# Altium project EVK-IRIS-W1-Mikro-Bus.PrjPcb (part 2 of 5)

## Sheet EVK-IRIS-W1-PIN-HEADERS_SDIO-HEADER.SchDoc
size A3; DocumentNumber: 13; SheetNumber: 13; SheetTotal: 14
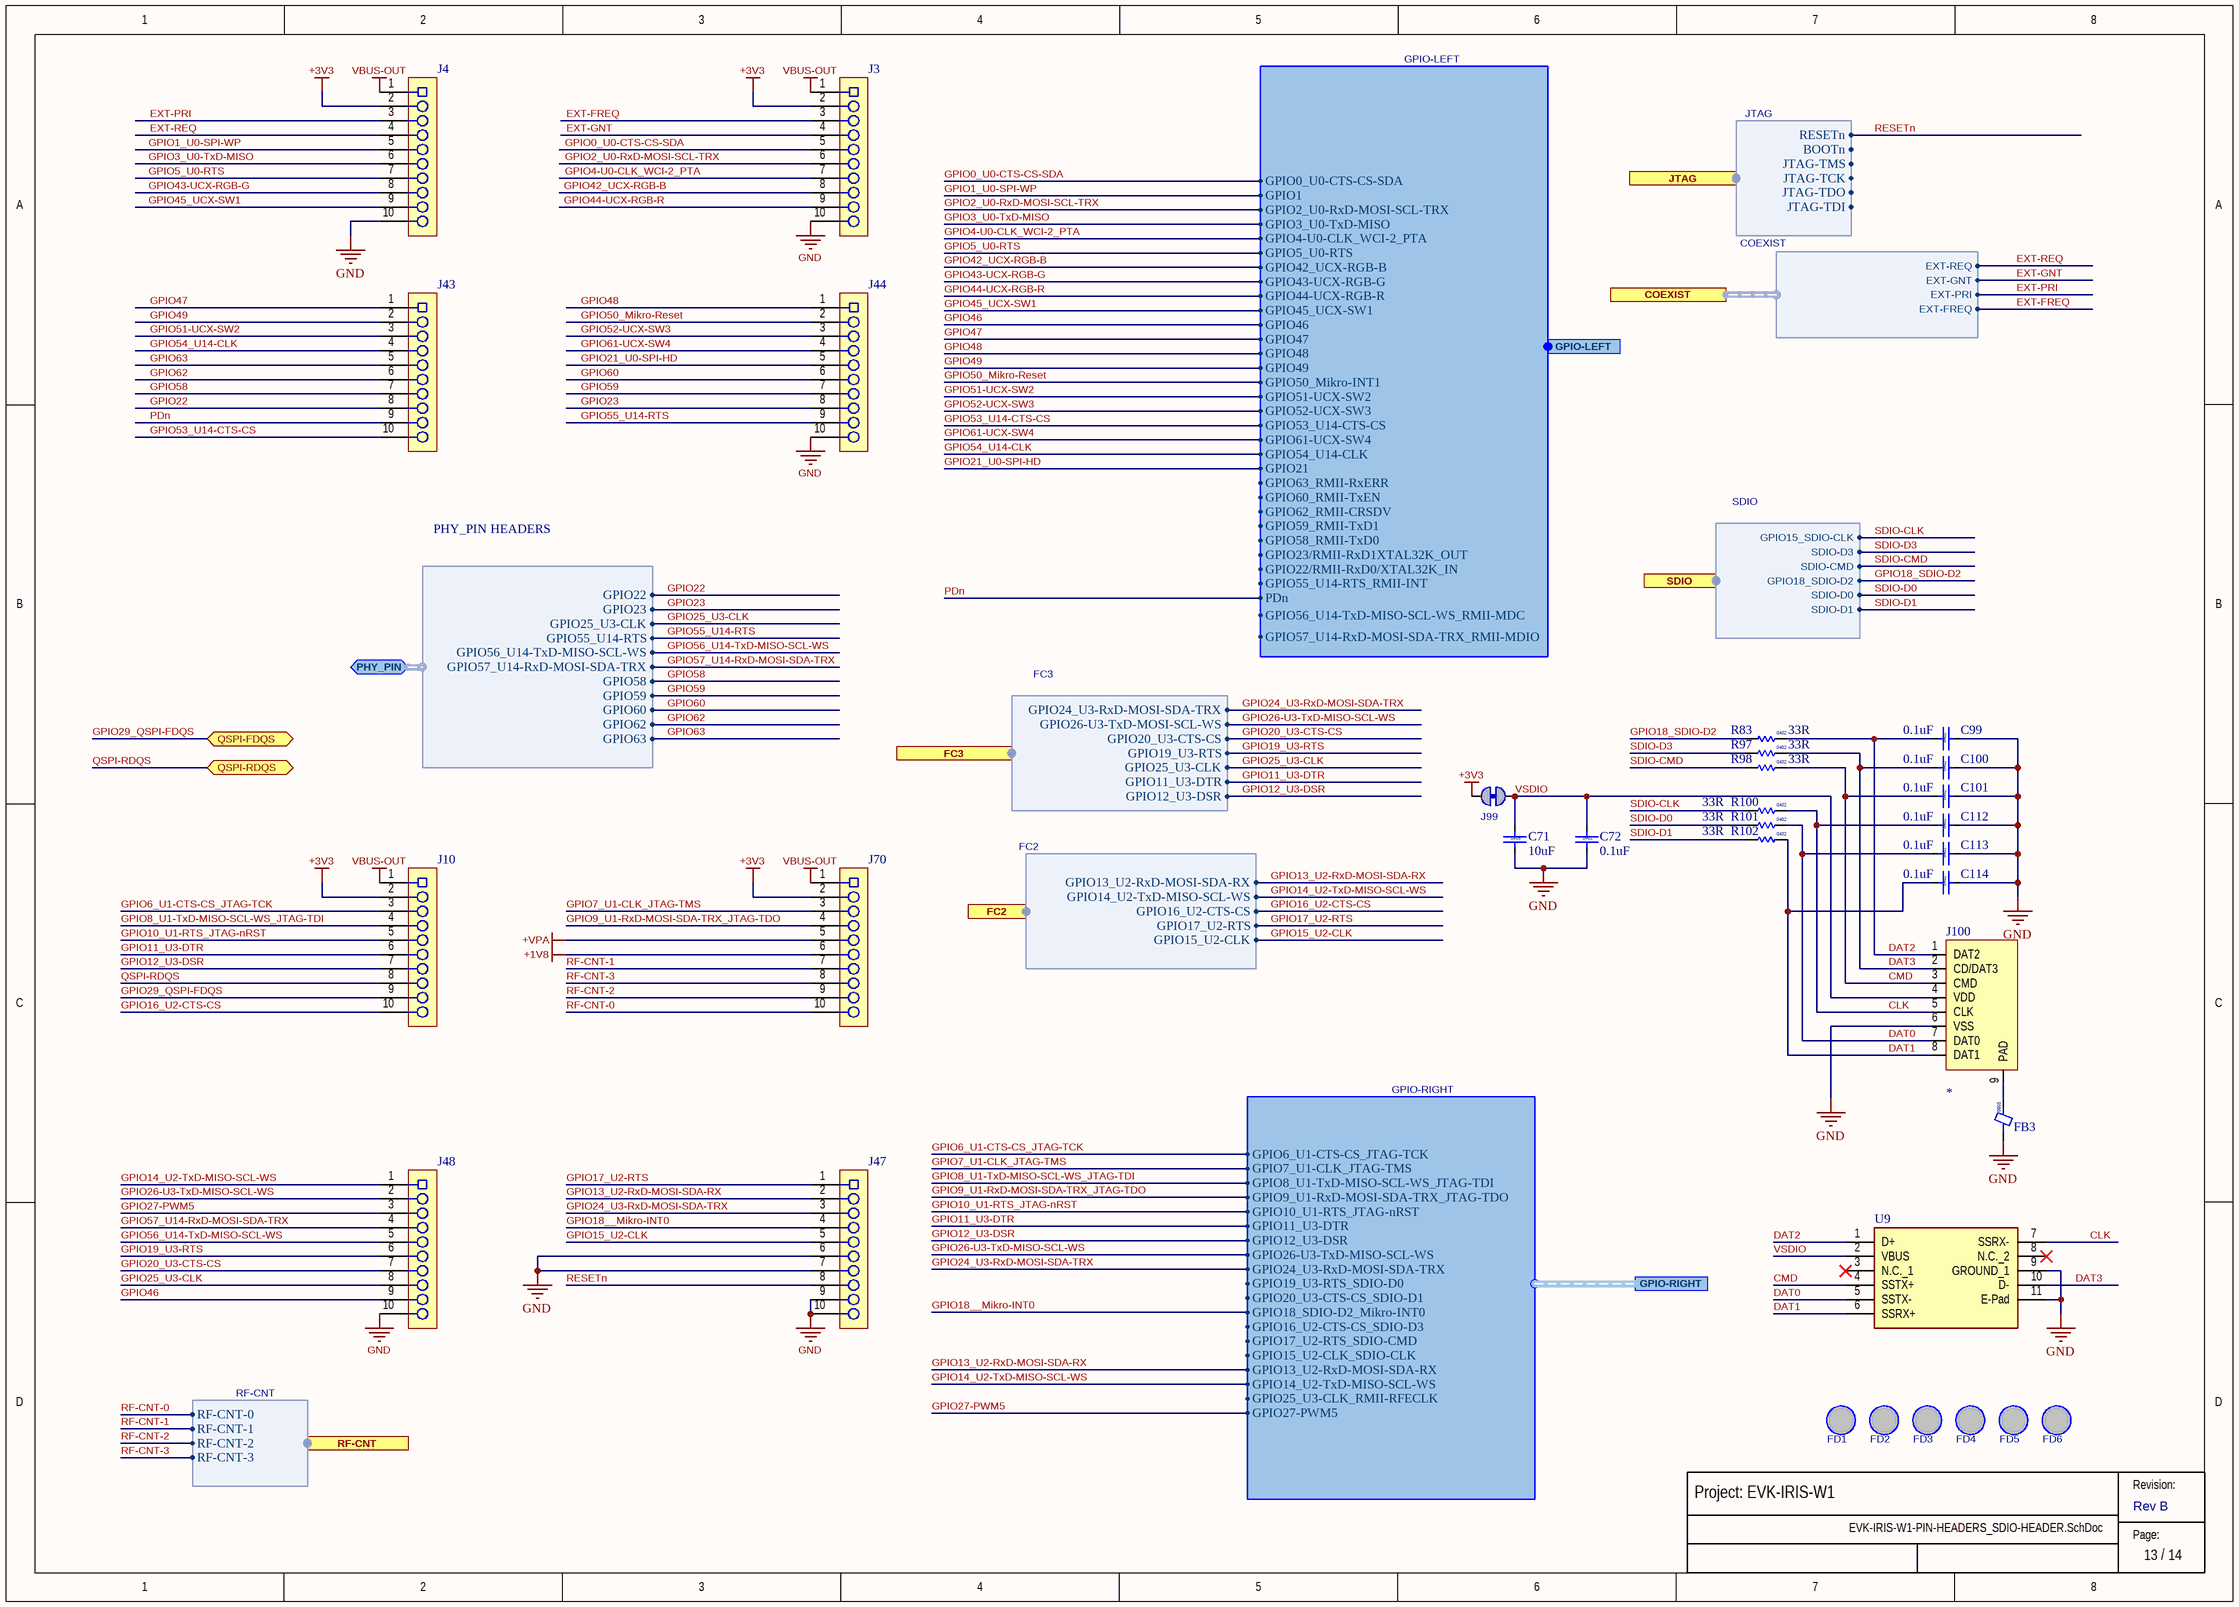
[diagram p4: EVK-IRIS-W1-PIN-HEADERS_SDIO-HEADER.SchDoc]

### Parts
C71  value 10uF  Size: 0805  [Cap 0805 HD]
C72  value 0.1uF  Size: 0402  [Cap 0402 HD]
C99  value 0.1uF  Size: 0402  [Cap 0402 HD]
C100  value 0.1uF  Size: 0402  [Cap 0402 HD]
C101  value 0.1uF  Size: 0402  [Cap 0402 HD]
C112  value 0.1uF  Size: 0402  [Cap 0402 HD]
C113  value 0.1uF  Size: 0402  [Cap 0402 HD]
C114  value 0.1uF  Size: 0402  [Cap 0402 HD]
FB3  Size: 0603  [BLM18EG221SN1]
FD1  Fiducial_1mmDNP  [Fiducial 1mm - Circle]  (value not drawn)  (no BOM)
FD2  Fiducial_1mmDNP  [Fiducial 1mm - Circle]  (value not drawn)  (no BOM)
FD3  Fiducial_1mmDNP  [Fiducial 1mm - Circle]  (value not drawn)  (no BOM)
FD4  Fiducial_1mmDNP  [Fiducial 1mm - Circle]  (value not drawn)  (no BOM)
FD5  Fiducial_1mmDNP  [Fiducial 1mm - Circle]  (value not drawn)  (no BOM)
FD6  Fiducial_1mmDNP  [Fiducial 1mm - Circle]  (value not drawn)  (no BOM)
J3  (no value)  [HDR-0.1P-10PIN-10x1-TH]
J4  (no value)  [HDR-0.1P-10PIN-10x1-TH]
J10  (no value)  [HDR-0.1P-10PIN-10x1-TH]
J43  (no value)  [HDR-0.1P-10PIN-10x1-TH]
J44  (no value)  [HDR-0.1P-10PIN-10x1-TH]
J47  (no value)  [HDR-0.1P-10PIN-10x1-TH]
J48  (no value)  [HDR-0.1P-10PIN-10x1-TH]
J70  (no value)  [HDR-0.1P-10PIN-10x1-TH]
J99  Solderbridge-ShortDNP  [Solderbridge-Short]  (value not drawn)  (net tie, no BOM)
J100  (no value)  [Micro_SD_SKT_SMT_RA]
R83  value 33R  Size: 0402  [RES 0402 HD]
R97  value 33R  Size: 0402  [RES 0402 HD]
R98  value 33R  Size: 0402  [RES 0402 HD]
R100  value 33R  Size: 0402  [RES 0402 HD]
R101  value 33R  Size: 0402  [RES 0402 HD]
R102  value 33R  Size: 0402  [RES 0402 HD]
U9  (no value)  [DFN10]

### Ports
COEXIST (harness COEXIST), FC2 (harness FC2), FC3 (harness FC3), GPIO-LEFT (harness GPIO-LEFT), GPIO-RIGHT (harness GPIO-RIGHT), JTAG (harness JTAG), PHY_PIN (bidir, harness PHY_PIN HEADERS), QSPI-FDQS (bidir), QSPI-RDQS (bidir), RF-CNT (harness RF-CNT), SDIO (harness SDIO)

### Harnesses
GPIO-RIGHT: GPIO6_U1-CTS-CS_JTAG-TCK, GPIO7_U1-CLK_JTAG-TMS, GPIO8_U1-TxD-MISO-SCL-WS_JTAG-TDI, GPIO9_U1-RxD-MOSI-SDA-TRX_JTAG-TDO, GPIO10_U1-RTS_JTAG-nRST, GPIO11_U3-DTR, GPIO12_U3-DSR, GPIO26-U3-TxD-MISO-SCL-WS, GPIO24_U3-RxD-MOSI-SDA-TRX, GPIO19_U3-RTS_SDIO-D0, GPIO20_U3-CTS-CS_SDIO-D1, GPIO18_SDIO-D2_Mikro-INT0, GPIO16_U2-CTS-CS_SDIO-D3, GPIO17_U2-RTS_SDIO-CMD, GPIO15_U2-CLK_SDIO-CLK, GPIO13_U2-RxD-MOSI-SDA-RX, GPIO14_U2-TxD-MISO-SCL-WS, GPIO25_U3-CLK_RMII-RFECLK, GPIO27-PWM5
RF-CNT: RF-CNT-0, RF-CNT-1, RF-CNT-2, RF-CNT-3
GPIO-LEFT: GPIO0_U0-CTS-CS-SDA, GPIO1, GPIO2_U0-RxD-MOSI-SCL-TRX, GPIO3_U0-TxD-MISO, GPIO4-U0-CLK_WCI-2_PTA, GPIO5_U0-RTS, GPIO42_UCX-RGB-B, GPIO43-UCX-RGB-G, GPIO44-UCX-RGB-R, GPIO45_UCX-SW1, GPIO46, GPIO47, GPIO48, GPIO49, GPIO50_Mikro-INT1, GPIO51-UCX-SW2, GPIO52-UCX-SW3, GPIO53_U14-CTS-CS, GPIO61-UCX-SW4, GPIO54_U14-CLK, GPIO21, GPIO63_RMII-RxERR, GPIO60_RMII-TxEN, GPIO62_RMII-CRSDV, GPIO59_RMII-TxD1, GPIO58_RMII-TxD0, GPIO23/RMII-RxD1XTAL32K_OUT, GPIO22/RMII-RxD0/XTAL32K_IN, GPIO55_U14-RTS_RMII-INT, PDn, GPIO56_U14-TxD-MISO-SCL-WS_RMII-MDC, GPIO57_U14-RxD-MOSI-SDA-TRX_RMII-MDIO
COEXIST: EXT-REQ, EXT-GNT, EXT-PRI, EXT-FREQ
SDIO: GPIO15_SDIO-CLK, SDIO-D3, SDIO-CMD, GPIO18_SDIO-D2, SDIO-D0, SDIO-D1
JTAG: JTAG-TCK, JTAG-TDI, JTAG-TDO, JTAG-TMS, BOOTn, RESETn
PHY_PIN HEADERS: GPIO22, GPIO23, GPIO25_U3-CLK, GPIO55_U14-RTS, GPIO56_U14-TxD-MISO-SCL-WS, GPIO57_U14-RxD-MOSI-SDA-TRX, GPIO58, GPIO59, GPIO60, GPIO62, GPIO63
FC2: GPIO13_U2-RxD-MOSI-SDA-RX, GPIO14_U2-TxD-MISO-SCL-WS, GPIO16_U2-CTS-CS, GPIO17_U2-RTS, GPIO15_U2-CLK
FC3: GPIO20_U3-CTS-CS, GPIO19_U3-RTS, GPIO24_U3-RxD-MOSI-SDA-TRX, GPIO26-U3-TxD-MOSI-SCL-WS, GPIO25_U3-CLK, GPIO11_U3-DTR, GPIO12_U3-DSR

### Nets
+1V8: J70.6
+3V3: J3.2 J4.2 J10.2 J70.2 J99.1
+VPA: J70.5
GND: C71.2 C72.2 C99.2 C100.2 C101.2 C112.2 C113.2 C114.2 FB3.1 J3.10 J4.10 J44.10 J47.6 J47.7 J47.9 J47.10 J48.10 J100.6(VSS) U9.9(GROUND_1) U9.11(E-Pad)
VBUS-OUT: J3.1 J4.1 J10.1 J70.1
CLK: C112.1 J100.5(CLK) R100.2 U9.7(SSRX-)
CMD: C101.1 J100.3(CMD) R98.2 U9.4(SSTX+)
DAT0: C113.1 J100.7(DAT0) R101.2 U9.5(SSTX-)
DAT1: C114.1 J100.8(DAT1) R102.2 U9.6(SSRX+)
DAT2: C99.1 J100.1(DAT2) R83.2 U9.1(D+)
DAT3: C100.1 J100.2(CD/DAT3) R97.2 U9.10(D-)
EXT-FREQ: J3.3 ; port COEXIST.EXT-FREQ
EXT-GNT: J3.4 ; port COEXIST.EXT-GNT
EXT-PRI: J4.3 ; port COEXIST.EXT-PRI
EXT-REQ: J4.4 ; port COEXIST.EXT-REQ
GPIO0_U0-CTS-CS-SDA: J3.5 ; port GPIO-LEFT.GPIO0_U0-CTS-CS-SDA
GPIO1_U0-SPI-WP: J4.5 ; port GPIO-LEFT.GPIO1
GPIO2_U0-RxD-MOSI-SCL-TRX: J3.6 ; port GPIO-LEFT.GPIO2_U0-RxD-MOSI-SCL-TRX
GPIO3_U0-TxD-MISO: J4.6 ; port GPIO-LEFT.GPIO3_U0-TxD-MISO
GPIO4-U0-CLK_WCI-2_PTA: J3.7 ; port GPIO-LEFT.GPIO4-U0-CLK_WCI-2_PTA  [project net GPIO4-U0-CLK]
GPIO5_U0-RTS: J4.7 ; port GPIO-LEFT.GPIO5_U0-RTS
GPIO6_U1-CTS-CS_JTAG-TCK: J10.3 ; port GPIO-RIGHT.GPIO6_U1-CTS-CS_JTAG-TCK
GPIO7_U1-CLK_JTAG-TMS: J70.3 ; port GPIO-RIGHT.GPIO7_U1-CLK_JTAG-TMS
GPIO8_U1-TxD-MISO-SCL-WS_JTAG-TDI: J10.4 ; port GPIO-RIGHT.GPIO8_U1-TxD-MISO-SCL-WS_JTAG-TDI
GPIO9_U1-RxD-MOSI-SDA-TRX_JTAG-TDO: J70.4 ; port GPIO-RIGHT.GPIO9_U1-RxD-MOSI-SDA-TRX_JTAG-TDO
GPIO10_U1-RTS_JTAG-nRST: J10.5 ; port GPIO-RIGHT.GPIO10_U1-RTS_JTAG-nRST
GPIO11_U3-DTR: J10.6 ; port GPIO-RIGHT.GPIO11_U3-DTR, port FC3.GPIO11_U3-DTR
GPIO12_U3-DSR: J10.7 ; port GPIO-RIGHT.GPIO12_U3-DSR, port FC3.GPIO12_U3-DSR
GPIO13_U2-RxD-MOSI-SDA-RX: J47.2 ; port GPIO-RIGHT.GPIO13_U2-RxD-MOSI-SDA-RX, port FC2.GPIO13_U2-RxD-MOSI-SDA-RX
GPIO14_U2-TxD-MISO-SCL-WS: J48.1 ; port GPIO-RIGHT.GPIO14_U2-TxD-MISO-SCL-WS, port FC2.GPIO14_U2-TxD-MISO-SCL-WS
GPIO15_U2-CLK: J47.5 ; port FC2.GPIO15_U2-CLK
GPIO16_U2-CTS-CS: J10.10 ; port FC2.GPIO16_U2-CTS-CS
GPIO17_U2-RTS: J47.1 ; port FC2.GPIO17_U2-RTS
GPIO18__Mikro-INT0: J47.4 ; port GPIO-RIGHT.GPIO18_SDIO-D2_Mikro-INT0
GPIO18_SDIO-D2: R83.1 ; port SDIO.GPIO18_SDIO-D2
GPIO19_U3-RTS: J48.6 ; port FC3.GPIO19_U3-RTS
GPIO20_U3-CTS-CS: J48.7 ; port FC3.GPIO20_U3-CTS-CS
GPIO21_U0-SPI-HD: J44.5 ; port GPIO-LEFT.GPIO21
GPIO22: J43.8 ; port PHY_PIN.GPIO22
GPIO23: J44.8 ; port PHY_PIN.GPIO23
GPIO24_U3-RxD-MOSI-SDA-TRX: J47.3 ; port GPIO-RIGHT.GPIO24_U3-RxD-MOSI-SDA-TRX, port FC3.GPIO24_U3-RxD-MOSI-SDA-TRX
GPIO25_U3-CLK: J48.8 ; port PHY_PIN.GPIO25_U3-CLK, port FC3.GPIO25_U3-CLK
GPIO26-U3-TxD-MISO-SCL-WS: J48.2 ; port GPIO-RIGHT.GPIO26-U3-TxD-MISO-SCL-WS, port FC3.GPIO26-U3-TxD-MOSI-SCL-WS
GPIO27-PWM5: J48.3 ; port GPIO-RIGHT.GPIO27-PWM5
GPIO29_QSPI-FDQS: J10.9 ; port QSPI-FDQS
GPIO42_UCX-RGB-B: J3.8 ; port GPIO-LEFT.GPIO42_UCX-RGB-B
GPIO43-UCX-RGB-G: J4.8 ; port GPIO-LEFT.GPIO43-UCX-RGB-G
GPIO44-UCX-RGB-R: J3.9 ; port GPIO-LEFT.GPIO44-UCX-RGB-R
GPIO45_UCX-SW1: J4.9 ; port GPIO-LEFT.GPIO45_UCX-SW1
GPIO46: J48.9 ; port GPIO-LEFT.GPIO46
GPIO47: J43.1 ; port GPIO-LEFT.GPIO47
GPIO48: J44.1 ; port GPIO-LEFT.GPIO48
GPIO49: J43.2 ; port GPIO-LEFT.GPIO49
GPIO50_Mikro-Reset: J44.2 ; port GPIO-LEFT.GPIO50_Mikro-INT1
GPIO51-UCX-SW2: J43.3 ; port GPIO-LEFT.GPIO51-UCX-SW2
GPIO52-UCX-SW3: J44.3 ; port GPIO-LEFT.GPIO52-UCX-SW3
GPIO53_U14-CTS-CS: J43.10 ; port GPIO-LEFT.GPIO53_U14-CTS-CS
GPIO54_U14-CLK: J43.4 ; port GPIO-LEFT.GPIO54_U14-CLK
GPIO55_U14-RTS: J44.9 ; port PHY_PIN.GPIO55_U14-RTS
GPIO56_U14-TxD-MISO-SCL-WS: J48.5 ; port PHY_PIN.GPIO56_U14-TxD-MISO-SCL-WS
GPIO57_U14-RxD-MOSI-SDA-TRX: J48.4 ; port PHY_PIN.GPIO57_U14-RxD-MOSI-SDA-TRX
GPIO58: J43.7 ; port PHY_PIN.GPIO58
GPIO59: J44.7 ; port PHY_PIN.GPIO59
GPIO60: J44.6 ; port PHY_PIN.GPIO60
GPIO61-UCX-SW4: J44.4 ; port GPIO-LEFT.GPIO61-UCX-SW4
GPIO62: J43.6 ; port PHY_PIN.GPIO62
GPIO63: J43.5 ; port PHY_PIN.GPIO63
PDn: J43.9 ; port GPIO-LEFT.PDn
QSPI-RDQS: J10.8 ; port QSPI-RDQS
RESETn: J47.8 ; port JTAG.RESETn
RF-CNT-0: J70.10 ; port RF-CNT.RF-CNT-0
RF-CNT-1: J70.7 ; port RF-CNT.RF-CNT-1
RF-CNT-2: J70.9 ; port RF-CNT.RF-CNT-2
RF-CNT-3: J70.8 ; port RF-CNT.RF-CNT-3
SDIO-CLK: R100.1 ; port SDIO.GPIO15_SDIO-CLK
SDIO-CMD: R98.1 ; port SDIO.SDIO-CMD
SDIO-D0: R101.1 ; port SDIO.SDIO-D0
SDIO-D1: R102.1 ; port SDIO.SDIO-D1
SDIO-D3: R97.1 ; port SDIO.SDIO-D3
VSDIO: C71.1 C72.1 J99.2 J100.4(VDD) U9.2(VBUS)
NetFB3_2: FB3.2 J100.9(PAD)

Not connected (* = marked no-connect by the designer): U9 3(N.C._1)* 8(N.C._2)*

### Notes on the sheet
- Revision:
- Page:

### Library data of the parts
C71 = 120-00133: Capacitor, Ceramic, 10uF 16V 10% X7R, 0805; Manufacturer 1: Samsung Electro-Mechanics America, Inc.; Manufacturer Part Number 1: CL21B106KOQNNNE; Part Name: CAP CER 10uF 16V 10% X7R 0805; Item Phase: Pre-Production; Tolerance: +/- 10%; Use in new designs: Yes; UBX Code: None; Part Number: 120-00133; Supplier 1: Digi-Key; Supplier Part Number 1: 1276-2872-1-ND; Manufacturer 2: Yageo; Manufacturer Part Number 2: CC0805KKX7R7BB106; Supplier 2: Digi-Key; Supplier Part Number 2: 311-3501-2-ND; Height: 1.40mm; Max Operating Temp: 125; Min Operating Temp: -55; Pins: 2; Revision: 1; Temperature Coefficient: X7R; Voltage: 16V
C72 C99-C101 C112-C114 = 120-00077: Cap, Ceramic 0.1uF 16V 10% X7R 0402.; Manufacturer 1: Murata Electronics North America; Manufacturer Part Number 1: GRM155R71C104KA88D; Part Name: CAP CER 0.1uF 16V 10% X7R 0402; Item Phase: In Production; Tolerance: +/- 10%; Use in new designs: Yes; UBX Code: None; Part Number: 120-00077; Supplier 1: Digi-Key; Supplier Part Number 1: 490-3261-1-ND; Manufacturer 2: AVX Corporation; Manufacturer Part Number 2: 0402YC104KAT2A; Supplier 2: Digi-Key; Supplier Part Number 2: 478-7888-1-ND; Height: 0.55mm; Max Operating Temp: 125; Min Operating Temp: -55; Pins: 2; Revision: 0C; Temperature Coefficient: X7R; Voltage: 16V
FB3 = BLM18EG221SN1: Ferrite Bead, 220ohm @ 100MHz, 2A, 0603; Manufacturer 1: Murata Electronics North America; Manufacturer Part Number 1: BLM18EG221SN1D; Part Name: Ferrite Bead 220ohm 2A 0503; Body Size: None; Item Phase: Unreleased; Use in new designs: Yes; Value: None; Part Number: BLM18EG221SN1; Supplier 1: Digi-Key; Supplier Part Number 1: 490-3992-2-ND; Current: 2A; Height: 0.8mm; MFG Package: None; Max Operating Temp: 85; Min Operating Temp: -55; Pins: None; Revision: None; Voltage: None; Manufacturer 2: None; Manufacturer Part Number 2: None; Supplier 2: None; Supplier Part Number 2: None; UBX Code: None
FD1-FD6 = Fiducial_1mm_Circle: 1mm Fiducial Target; Added By: EMOO; Part Number: Fiducial_1mm; Height: 0; DNP: DNP; Added Date: 12/12/2020
J3 J4 J10 J43 J44 J47 J48 J70 = 130-00046: Header, 0.100" Pitch, 10Pin, 10x1, Through Hole; Part Name: CON Header 0.1in 10Pin 1Row TH; Manufacturer 1: FCI; Manufacturer Part Number 1: 68002-210HLF; Use in new designs: Yes; Item Phase: Unreleased; Voltage: None; Part Number: 130-00046; Height: 0.32"; Pins: 10; Diameter: None; Max Operating Temp: None; Min Operating Temp: None; Revision: None; UBX Code: None; Manufacturer 2: None; Supplier 1: Digi-Key; Supplier Part Number 1: 609-3301-ND; Manufacturer Part Number 2: None; Supplier 2: None; Supplier Part Number 2: None; Manufacturer P/N: *
J99 = Solderbridge-Short: Added By: Paul B; Part Number: Solderbridge-Short; Height: 0; DNP: DNP; Added Date: 12/2/2015
J100 = 130-00062: Micro SD Card Socket, Right Angle, with 4 Ground Pads, SMT; Manufacturer 1: Molex Inc; Manufacturer Part Number 1: 0472192001; Part Name: CON Micro SD 1.1mm 8Pin 1Row SMT RA; Item Phase: In Production; Use in new designs: Yes; Voltage: None; Manufacturer P/N: *; Part Number: 130-00062; Supplier 1: Digi-Key; Supplier Part Number 1: WM6698CT-ND; Diameter: None; Height: 1.9mm; Max Operating Temp: None; Min Operating Temp: None; Pins: 8; Revision: 0A; UBX Code: None; Manufacturer 2: None; Manufacturer Part Number 2: None; Supplier 2: None; Supplier Part Number 2: None
R83 R97 R98 R100-R102 = UBXH18-0008013: RES THICK FILM CHIP 0402 33R 5% 50V 63mW; Manufacturer: KOA; Manufacturer P/N: RK73B1ETTP330J; Editor: matej.budin; Env: ROHS; Permitted Use: Volume Products; Perferred: PREF; Mfg P/N Status: Active; Mfg P/N Split: 100; Mfg P/N Released: Yes; Released by: erian.bezhani; Part Number: UBXH18-0008013; Tolerance: 5%; Max Power: 63mW; Part Type: Resistor; UBX Wiki: https://wiki.u-blox.com/bin/view/Operations/PartDetails?index=6887; RefDes: R; Max Voltage: 50V; Release Data: 2013-01-10T15:04:42; Mfg P/N Datasheet: https://wiki.u-blox.com/bin/view/Generic/Docs/DocumentSummary?index=18259
U9 = CDDFN10-0516P: 4.5V, 7.2V Clamp 4A (8/20µs) Ipp Tvs Diode Surface Mount 10-DFN (4.1x2); Mfr_Name: BOURNS; RefDes: RefDes; Type: Type; Manufacturer P/N: *

## Sheet EVK-IRIS-W1-PowerSchDoc.SchDoc
size A3; DocumentNumber: 3; SheetNumber: 3; SheetTotal: 14
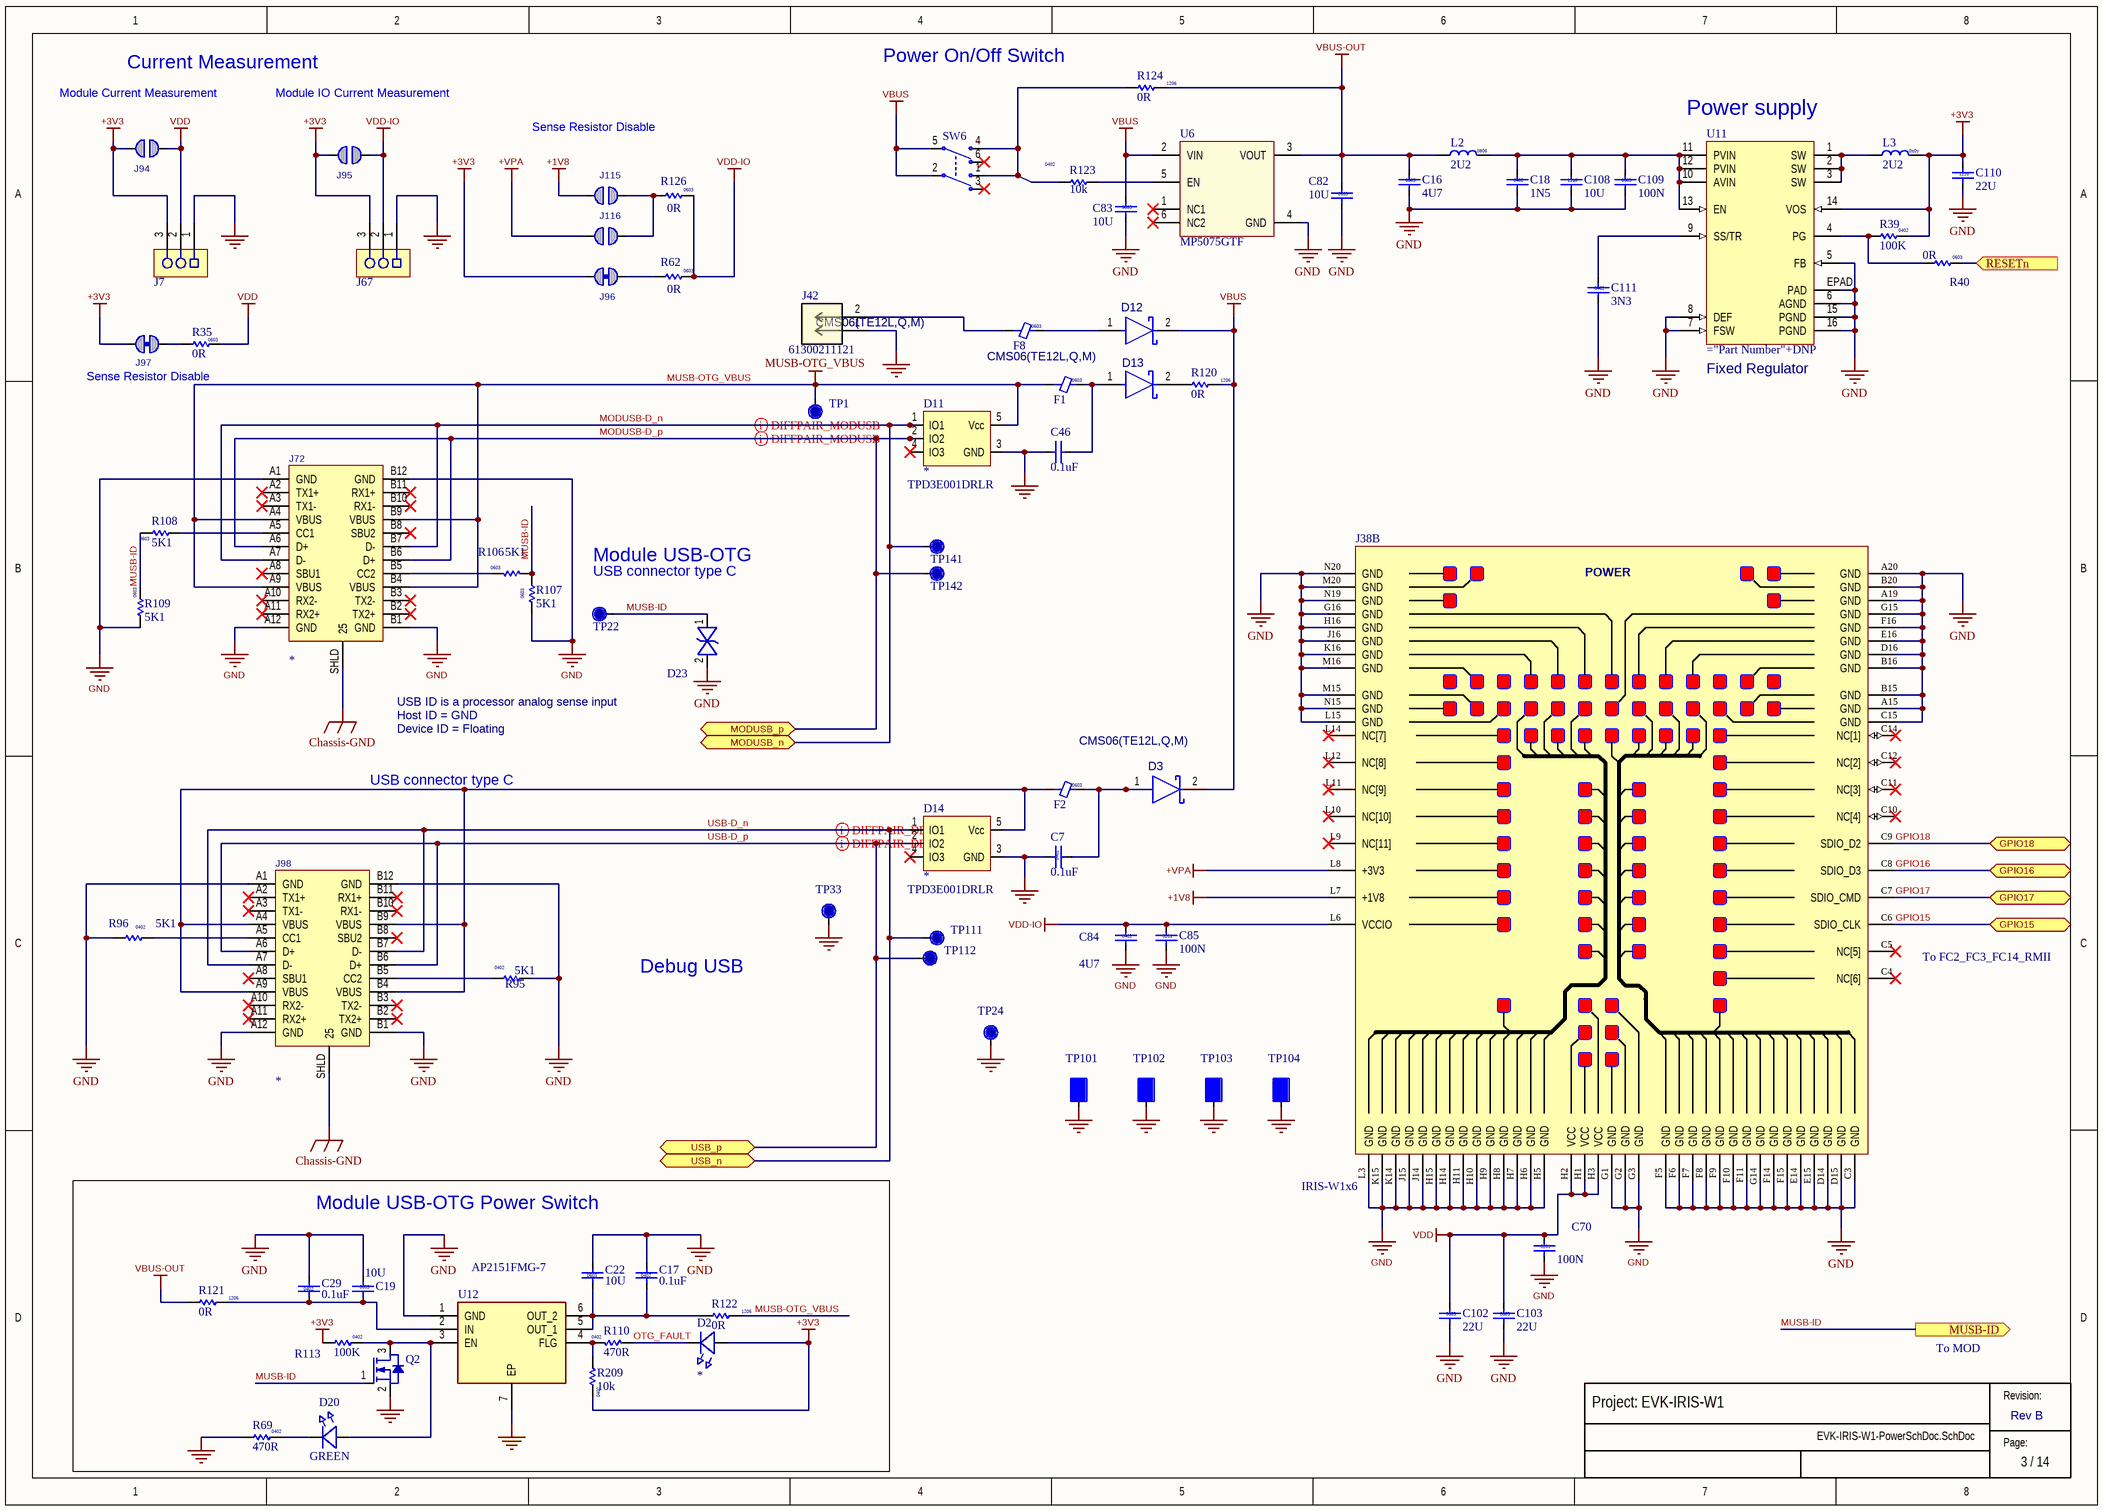
[diagram p5: EVK-IRIS-W1-PowerSchDoc.SchDoc]

### Parts
C7  value 0.1uF  Size: 0402  [Cap 0402 HD]
C16  value 4U7  Size: 0805  [Cap 0805]
C17  value 0.1uF  Size: 0402  [Cap 0402 HD]
C18  value 1N5  Size: 0402  [CAP 0402]
C19  value 10U  Size: 0603  [Cap 0603 HD]
C22  value 10U  Size: 0603  [Cap 0603 HD]
C29  value 0.1uF  Size: 0402  [Cap 0402 HD]
C46  value 0.1uF  [Cap 0402 HD]
C70  value 100N  Size: 0201  [Cap 0201 HD]
C82  value 10U  Size: 0603  [Cap 0603 HD]
C83  value 10U  Size: 0603  [Cap 0603 HD]
C84  value 4U7  Size: 0402  [Cap 0402 HD]
C85  value 100N  Size: 0201  [Cap 0201 HD]
C102  value 22U  Size: 0603  [Cap 0603]
C103  value 22U  Size: 0603  [Cap 0603]
C108  value 10U  Size: 1210  [Cap 1210]
C109  value 100N  Size: 0603  [Cap 0603 HD]
C110  value 22U  Size: 1210  [Cap 1210]
C111  value 3N3  Size: 0402  [CAP 0402]
D2  (no value)  [LED-0603]
D3  CMS06(TE12L,Q,M)  [FP-M-FLAT-MFG]
D11  Manufacturer Part Number 1: TPD3E001DRLR  [SOT-553]
D12  CMS06(TE12L,Q,M)  [FP-M-FLAT-MFG]
D13  CMS06(TE12L,Q,M)  [FP-M-FLAT-MFG]
D14  Manufacturer Part Number 1: TPD3E001DRLR  [SOT-553]
D20  value GREEN  [LED-0603]
D23  (no value)  [SOD-923]
F1  Size: 0603  [IND 0603]
F2  Size: 0603  [IND 0603]
F8  Size: 0603  [IND 0603]
J7  (no value)  [HDR-0.1P-3Pin-1Row-SMT]
J38  IRIS-W1x6  [IRIS-W1x6_LGA152]  (part B of 2)
J42  61300211121  [CONN_61300211121_WRE]
J67  (no value)  [HDR-0.1P-3Pin-1Row-SMT]
J72  (no value)  [CON_USB-C-RA_W-6Tabs]
J94  Solderbridge-OpenDNP  [Solderbridge-Open]  (value not drawn)  (no BOM)
J95  Solderbridge-OpenDNP  [Solderbridge-Open]  (value not drawn)  (no BOM)
J96  Solderbridge-ShortDNP  [Solderbridge-Short]  (value not drawn)  (net tie, no BOM)
J97  Solderbridge-ShortDNP  [Solderbridge-Short]  (value not drawn)  (net tie, no BOM)
J98  (no value)  [CON_USB-C-RA_W-6Tabs]
J115  Solderbridge-OpenDNP  [Solderbridge-Open]  (value not drawn)  (no BOM)
J116  Solderbridge-OpenDNP  [Solderbridge-Open]  (value not drawn)  (no BOM)
L2  value 2U2  Size: 0806  [IND 0806]
L3  value 2U2  Size: 0x0y  [Ind_4mmx4mm]
Q2  (no value)  [SOT-323]
R35  value 0R  Size: 0603  [RES 0603 HD]
R39  value 100K  Size: 0402  [RES 0402 HD]
R40  value 0R  Size: 0603  [RES 0603 HD]
R62  value 0R  Size: 0603  [RES 0603 HD]
R69  value 470R  Size: 0402  [RES 0402 HD]
R95  value 5K1  Size: 0402  [RES 0402 HD]
R96  value 5K1  Size: 0402  [RES 0402 HD]
R106  value 5K1  Size: 0603  [RES 0603 HD]
R107  value 5K1  Size: 0603  [RES 0603 HD]
R108  value 5K1  Size: 0603  [RES 0603 HD]
R109  value 5K1  Size: 0603  [RES 0603 HD]
R110  value 470R  Size: 0402  [RES 0402 HD]
R113  value 100K  Size: 0402  [RES 0402 HD]
R120  value 0R  Size: 1206  [RES 1206]
R121  value 0R  Size: 1206  [RES 1206]
R122  value 0R  Size: 1206  [RES 1206]
R123  value 10k  Size: 0402  [RES 0402 HD]
R124  value 0R  Size: 1206  [RES 1206]
R126  value 0R  Size: 0603  [RES 0603 HD]  (hidden comment: R126)
R209  value 10k  Size: 0402  [RES 0402 HD]
SW6  (no value)  [SW_Slide_DPDT_JS202011SCQN]
TP1  TP  [TP10R]  (value not drawn)
TP22  TP  [TP10R]  (value not drawn)
TP24  TP  [TP10R]  (value not drawn)
TP33  TP  [TP10R]  (value not drawn)
TP101  TP4.5x3SqDNP  [TP4.5x3Sq]  (value not drawn)
TP102  TP4.5x3SqDNP  [TP4.5x3Sq]  (value not drawn)
TP103  TP4.5x3SqDNP  [TP4.5x3Sq]  (value not drawn)
TP104  TP4.5x3SqDNP  [TP4.5x3Sq]  (value not drawn)
TP111  TP  [TP10R]  (value not drawn)
TP112  TP  [TP10R]  (value not drawn)
TP141  TP  [TP10R]  (value not drawn)
TP142  TP  [TP10R]  (value not drawn)
U6  MP5075GTF  [SOT-563]
U11  (no value)  [QFN0.5P3x3-16Pin_W-Pad]
U12  AP2151FMG-7  [SON50P201X181X60-7N]

### Blocks framed on the sheet
Module USB-OTG Power Switch: C17 C19 C22 C29 D2 D20 Q2 R69 R110 R113 R121 R122 R209 U12

### Ports
GPIO15 (bidir), GPIO16 (bidir), GPIO17 (bidir), GPIO18 (bidir), MODUSB_n (bidir), MODUSB_p (bidir), MUSB-ID (out), RESETn (in), USB_n (bidir), USB_p (bidir)

### Nets
+1V8: J38.L7(+1V8) J115.1
+3V3: C110.1 D2.2(A) J7.3 J67.3 J94.1 J95.1 J96.1 J97.1 L3.2 R39.2 R113.1 R209.2 U11.14(VOS)
+VPA: J38.L8(+3V3) J116.1
Chassis-GND: J72.SHLD(25) J98.SHLD(25)
GND: C7.1 C16.2 C17.2 C18.2 C19.1 C22.1 C29.2 C46.1 C70.2 C82.2 C83.2 C84.2 C85.2 C102.2 C103.2 C108.2 C109.2 C110.2 C111.2 D11.3(GND) D14.3(GND) D23.2 J7.1 J38.A15(GND) J38.A19(GND) J38.A20(GND) J38.B15(GND) J38.B16(GND) J38.B20(GND) J38.C3(GND) J38.C15(GND) J38.D14(GND) J38.D15(GND) J38.D16(GND) J38.E14(GND) J38.E15(GND) J38.E16(GND) J38.F5(GND) J38.F6(GND) J38.F7(GND) J38.F8(GND) J38.F9(GND) J38.F10(GND) J38.F11(GND) J38.F14(GND) J38.F15(GND) J38.F16(GND) J38.G1(GND) J38.G2(GND) J38.G3(GND) J38.G14(GND) J38.G15(GND) J38.G16(GND) J38.H5(GND) J38.H6(GND) J38.H7(GND) J38.H8(GND) J38.H9(GND) J38.H10(GND) J38.H11(GND) J38.H14(GND) J38.H15(GND) J38.H16(GND) J38.J14(GND) J38.J15(GND) J38.J16(GND) J38.K14(GND) J38.K15(GND) J38.K16(GND) J38.L3(GND) J38.L15(GND) J38.M15(GND) J38.M16(GND) J38.M20(GND) J38.N15(GND) J38.N19(GND) J38.N20(GND) J42.1 J67.1 J72.A1(GND) J72.A12(GND) J72.B1(GND) J72.B12(GND) J98.A1(GND) J98.A12(GND) J98.B1(GND) J98.B12(GND) Q2.2(S) R69.1 R95.2 R96.1 R107.2 R109.1 TP24.1 TP33.1 TP101.1 TP102.1 TP103.1 TP104.1 U6.4(GND) U11.5(FB) U11.6(AGND) U11.7(FSW) U11.8(DEF) U11.15(PGND) U11.16(PGND) U11.EPAD(PAD) U12.1(GND) U12.7(EP)
MUSB-OTG_VBUS: D11.5(Vcc) F1.1 J72.A4(VBUS) J72.A9(VBUS) J72.B4(VBUS) J72.B9(VBUS) R122.2 TP1.1
VBUS: C83.1 D3.2(C) D12.2(C) R120.2 SW6.2(COM-1) SW6.5(COM-2) U6.2(VIN)
VBUS-OUT: C16.1 C82.1 L2.1 R121.1 R124.2 U6.3(VOUT)
VDD: C70.1 C102.1 C103.1 J7.2 J38.H1(VCC) J38.H2(VCC) J38.H3(VCC) J94.2 R35.1
VDD-IO: C84.1 C85.1 J38.L6(VCCIO) J67.2 J95.2 R62.2 R126.2
GPIO15: J38.C6(SDIO_CLK) ; port GPIO15
GPIO16: J38.C8(SDIO_D3) ; port GPIO16
GPIO17: J38.C7(SDIO_CMD) ; port GPIO17
GPIO18: J38.C9(SDIO_D2) ; port GPIO18
MODUSB-D_n: D11.1(IO1) J72.A7(D-) J72.B7(D-) TP141.1 ; port MODUSB_n
MODUSB-D_p: D11.2(IO2) J72.A6(D+) J72.B6(D+) TP142.1 ; port MODUSB_p
MUSB-ID: D23.1 Q2.1(G) R106.1 R107.1 R108.2 R109.2 TP22.1 ; port MUSB-ID
OTG_FAULT: D2.1(C) R110.1
RESETn: R40.2 ; port RESETn
USB-D_n: D14.1(IO1) J98.A7(D-) J98.B7(D-) TP111.1 ; port USB_n
USB-D_p: D14.2(IO2) J98.A6(D+) J98.B6(D+) TP112.1 ; port USB_p
NetC7_2: C7.2 D3.1(A) F2.2
NetC17_1: C17.1 C22.2 R122.1 U12.5(OUT_1) U12.6(OUT_2)
NetC18_1: C18.1 C108.1 C109.1 L2.2 U11.10(AVIN) U11.11(PVIN) U11.12(PVIN) U11.13(EN)
NetC19_2: C19.2 C29.1 R121.2 U12.2(IN)
NetC46_2: C46.2 D13.1(A) F1.2
NetC111_1: C111.1 U11.9(SS/TR)
NetD12_1: D12.1(A) F8.2
NetD13_2: D13.2(C) R120.1
NetD14_5: D14.5(Vcc) F2.1 J98.A4(VBUS) J98.A9(VBUS) J98.B4(VBUS) J98.B9(VBUS)
NetD20_1: D20.1(C) R69.2
NetD20_2: D20.2(A) Q2.3(D) R113.2 U12.3(EN)
NetF8_1: F8.1 J42.2
NetJ72_A5: J72.A5(CC1) R108.1
NetJ72_B5: J72.B5(CC2) R106.2
NetJ96_2: J96.2 R62.1
NetJ97_2: J97.2 R35.2
NetJ98_A5: J98.A5(CC1) R96.2
NetJ98_B5: J98.B5(CC2) R95.1
NetJ115_2: J115.2 J116.2 R126.1
NetL3_1: L3.1 U11.1(SW) U11.2(SW) U11.3(SW)
NetR39_1: R39.1 R40.1 U11.4(PG)
NetR110_2: R110.2 R209.1 U12.4(FLG)
NetR123_1: R123.1 U6.5(EN)
NetR123_2: R123.2 R124.1 SW6.1(N.O-1) SW6.4(N.O-2)

Not connected (* = marked no-connect by the designer): D11 4(IO3)*; D14 4(IO3)*; J38 C4(NC[6])* C5(NC[5])* C10(NC[4])* C11(NC[3])* C12(NC[2])* C14(NC[1])* L9(NC[11])* L10(NC[10])* L11(NC[9])* L12(NC[8])* L14(NC[7])*; J72 A2(TX1+)* A3(TX1-)* A8(SBU1)* A10(RX2-)* A11(RX2+)* B2(TX2+)* B3(TX2-)* B8(SBU2)* B10(RX1-)* B11(RX1+)*; J98 A2(TX1+)* A3(TX1-)* A8(SBU1)* A10(RX2-)* A11(RX2+)* B2(TX2+)* B3(TX2-)* B8(SBU2)* B10(RX1-)* B11(RX1+)*; SW6 3(N.C-1)* 6(N.C-2)*; U6 1(NC1)* 6(NC2)*

### Layout directives
differential pair; differential pair class USB_DIFF; net class USB_DIFF: MODUSB-D_n, MODUSB-D_p, USB-D_n, USB-D_p

### Notes on the sheet
- (near J94) Module Current Measurement
- Current Measurement
- Module IO Current Measurement
- Power On/Off Switch
- Sense Resistor Disable
- (near U11) Power supply
- (near U11) Fixed Regulator
- Module USB-OTG
- USB connector type C
- USB ID is a processor analog sense input
- Host ID = GND
- Device ID = Floating
- Debug USB
- (near J38) To FC2_FC3_FC14_RMII
- To MOD
- Revision:
- Page:
- (in symbol UBXH14-0000681, part B) POWER

### Library data of the parts
C7 C17 C29 C46 = 120-00016: Cap, Ceramic 0.1uF 10V 10% X5R 0402; Part Name: CAP CER 0.1UF 10V 10% X5R 0402; Manufacturer 1: Murata Electronics North America; Manufacturer Part Number 1: GRM155R61A104KA01J; Tolerance: +/- 10%; Use in new designs: Yes; UBX Code: None; Item Phase: In Production; Part Number: 120-00016; Revision: 0A; Supplier 1: Digi-Key; Supplier Part Number 1: 490-6297-1-ND; Manufacturer 2: Yageo; Supplier 2: Digi-Key; Supplier Part Number 2: 311-1336-1-ND; Height: 0.55mm; Pins: 2; Temperature Coefficient: X5R; Voltage: 10V; Max Operating Temp: 85; Manufacturer Part Number 2: CC0402KRX5R6BB104; Min Operating Temp: -55
C16 = UBXH01-0000007: CAP CER X5R 0805 4U7 10% 25V; Manufacturer: Murata Manufacturing Company, Ltd.; Manufacturer P/N: GRM21BR61E475KA12; Editor: par.hakansson; Released by: adam.johansson; Env: ROHS; Permitted Use: Volume Products; Perferred: PREF; Mfg P/N Status: NRND; Mfg P/N Split: 100; Mfg P/N Released: Yes; Part Number: UBXH01-0000007; Tolerance: 10%; Max Voltage: 25V; Min Operating Temp: -40°C; Max Operating Temp: 85°C; Part Type: Capacitor; Release Data: 2016-03-01T15:08:08; UBX Wiki: https://wiki.u-blox.com/bin/view/Operations/PartDetails?index=8070; RefDes: C; Mfg P/N Datasheet: https://wiki.u-blox.com/bin/view/Generic/Docs/DocumentSummary?index=24274
C18 = UBXH01-0000211: CAP CER X7R 0402 1N5 10% 50V; Manufacturer: Murata Manufacturing Company, Ltd.; Manufacturer P/N: GRM155R71H152KA01; Editor: domenico.volpe; Released by: massimo.vlacci; Env: ROHS; Permitted Use: Volume Products; Perferred: PREF; Mfg P/N Status: NRND; Mfg P/N Split: 100; Mfg P/N Released: Yes; Part Number: UBXH01-0000211; Tolerance: 10%; Max Voltage: 50V; Min Operating Temp: -55°C; Max Operating Temp: 125°C; Part Type: Capacitor; Release Data: 2015-11-04T16:43:52; UBX Wiki: https://wiki.u-blox.com/bin/view/Operations/PartDetails?index=23369; RefDes: C; Mfg P/N Datasheet: https://wiki.u-blox.com/bin/view/Generic/Docs/DocumentSummary?index=23371; Manufacturer 2: Samsung Electro-Mechanics; Manufacturer P/N 2: CL05B152KB5NNN; Mfg P/N Status 2: Active; Mfg P/N Split 2: 0; Mfg P/N Released 2: Yes; Mfg P/N Datasheet 2: https://wiki.u-blox.com/bin/view/Generic/Docs/DocumentSummary?index=23370
C19 C22 C82 C83 = UBXH01-0000310: CAP CER X7R 0603 10U 20% 10V; Manufacturer: Murata Manufacturing Company, Ltd.; Manufacturer P/N: GRM188Z71A106MA73; Editor: michael.hein; Released by: martin.grasse; Env: ROHS; Permitted Use: Volume Products; Perferred: PREF; Mfg P/N Status: Active; Mfg P/N Split: 100; Mfg P/N Released: Yes; Part Number: UBXH01-0000310; Tolerance: 20%; Max Voltage: 10V; Min Operating Temp: -55°C; Max Operating Temp: 125°C; Part Type: Capacitor; Release Data: 2017-02-09T11:14:05; UBX Wiki: https://wiki.u-blox.com/bin/view/Operations/PartDetails?index=26280; RefDes: C; Mfg P/N Datasheet: https://wiki.u-blox.com/bin/view/Generic/Docs/DocumentSummary?index=26282; Manufacturer 2: Murata Manufacturing Company, Ltd.; Manufacturer P/N 2: GRM188Z71A106KA73; Mfg P/N Status 2: Active; Mfg P/N Split 2: 0; Mfg P/N Released 2: Yes; Mfg P/N Datasheet 2: https://wiki.u-blox.com/bin/view/Generic/Docs/DocumentSummary?index=28416
C70 C85 = UBXH01-0000245: CAP CER X5R 0201 100N 10% 10V; Manufacturer: Murata Manufacturing Company, Ltd.; Manufacturer P/N: GRM033R61A104KE84; Editor: dario.antonaz; Released by: jure.podmenik; Env: ROHS; Permitted Use: Volume Products; Perferred: PREF; Mfg P/N Status: Active; Mfg P/N Split: 0; Mfg P/N Released: Yes; Part Number: UBXH01-0000245; Tolerance: 10%; Max Voltage: 10V; Min Operating Temp: -40°C; Max Operating Temp: 85°C; Part Type: Capacitor; Release Data: 2016-03-11T16:09:03; UBX Wiki: https://wiki.u-blox.com/bin/view/Operations/PartDetails?index=24347; RefDes: C; Mfg P/N Datasheet: https://wiki.u-blox.com/bin/view/Generic/Docs/DocumentSummary?index=24348; Manufacturer 2: Taiyo Yuden Company, Ltd.; Manufacturer P/N 2: LMK063BJ104KP-F; Mfg P/N Status 2: Active; Mfg P/N Split 2: 0; Mfg P/N Released 2: Yes; Mfg P/N Datasheet 2: https://wiki.u-blox.com/bin/view/Generic/Docs/DocumentSummary?index=27440; Manufacturer 3: Samsung Electro-Mechanics; Manufacturer P/N 3: CL03A104KA3NNN; Mfg P/N Status 3: Active; Mfg P/N Split 3: 0; Mfg P/N Released 3: Yes; Mfg P/N Datasheet 3: https://wiki.u-blox.com/bin/view/Generic/Docs/DocumentSummary?index=28183
C84 = UBXH01-0000243: CAP CER X5R 0402 4U7 20% 10V; Manufacturer: Murata Manufacturing Company, Ltd.; Manufacturer P/N: GRM155R61A475MEAA; Editor: martin.pilik; Released by: fabrice.bret-dibat; Env: GREEN; Permitted Use: Volume Products; Perferred: PREF; Mfg P/N Status: Active; Mfg P/N Split: 100; Mfg P/N Released: Yes; Part Number: UBXH01-0000243; Tolerance: 20%; Max Voltage: 10V; Min Operating Temp: -40°C; Max Operating Temp: 85°C; Part Type: Capacitor; Release Data: 2021-05-10T12:57:47; UBX Wiki: https://wiki.u-blox.com/bin/view/Operations/PartDetails?index=24303; RefDes: C; Mfg P/N Datasheet: https://wiki.u-blox.com/bin/view/Generic/Docs/DocumentSummary?index=24302
C102 C103 = UBXH01-0000150: CAP CER X5R 0603 22U 20% 10V; Manufacturer: Murata Manufacturing Company, Ltd.; Manufacturer P/N: GRM188R61A226ME15D; Editor: dario.antonaz; Released by: pasquale.scorca; Env: ROHS; Permitted Use: Volume Products; Perferred: PREF; Mfg P/N Status: Active; Mfg P/N Split: 100; Mfg P/N Released: Yes; Part Number: UBXH01-0000150; Tolerance: 20%; Max Voltage: 10V; Part Type: Capacitor; Release Data: 2016-03-09T11:21:55; UBX Wiki: https://wiki.u-blox.com/bin/view/Operations/PartDetails?index=21275; RefDes: C; Mfg P/N Datasheet: https://wiki.u-blox.com/bin/view/Generic/Docs/DocumentSummary?index=21277
C108 = UBXH01-3001004: CAP CER X5R 1210 10U 10% 25V; Manufacturer: Murata Manufacturing Company, Ltd.; Manufacturer P/N: GRM32DR61E106KA12; Editor: andreas.thiel; Released by: johann.furrer; Env: ROHS; Permitted Use: Volume Products; Perferred: NONPREF; Mfg P/N Status: NRND; Mfg P/N Split: 100; Mfg P/N Released: Yes; Part Number: UBXH01-3001004; Tolerance: 10%; Max Voltage: 25V; Part Type: Capacitor; Release Data: 2010-04-01T16:00:35; UBX Wiki: https://wiki.u-blox.com/bin/view/Operations/PartDetails?index=5778; RefDes: C; Mfg P/N Datasheet: https://wiki.u-blox.com/bin/view/Generic/Docs/DocumentSummary?index=8644
C109 = UBXH01-0047032: CAP CER X7R 0603 100N 10% 25V; Manufacturer: Murata Manufacturing Company, Ltd.; Manufacturer P/N: GRM188R71E104KA01; Editor: andreas.thiel; Released by: philippe.largier; Env: ROHS; Permitted Use: Volume Products; Perferred: NONPREF; Mfg P/N Status: NRND; Mfg P/N Split: 100; Mfg P/N Released: Yes; Part Number: UBXH01-0047032; Tolerance: 10%; Max Voltage: 25V; Part Type: Capacitor; Release Data: 2015-06-10T08:26:38; UBX Wiki: https://wiki.u-blox.com/bin/view/Operations/PartDetails?index=5642; RefDes: C
C110 = UBXH01-3001005: CAP CER X5R 1210 22U 10% 25V; Manufacturer: Murata Manufacturing Company, Ltd.; Manufacturer P/N: GRM32ER61E226KE15; Editor: roland.rust; Env: ROHS; Permitted Use: Volume Products; Perferred: PREF; Mfg P/N Status: NRND; Mfg P/N Split: 100; Mfg P/N Released: Yes; Part Number: UBXH01-3001005; Tolerance: 10%; Max Voltage: 25V; Part Type: Capacitor; Released by: roland.rust; Release Data: 2009-04-24T15:51:56; UBX Wiki: https://wiki.u-blox.com/bin/view/Operations/PartDetails?index=5780; RefDes: C
C111 = UBXH01-0023019: CAP CER X7R 0402 3N3 10% 16V; Manufacturer: Murata Manufacturing Company, Ltd.; Manufacturer P/N: GRM155R71H332KA01; Editor: dario.antonaz; Released by: pierpaolo.arban; Env: ROHS; Permitted Use: Volume Products; Perferred: PREF; Mfg P/N Status: NRND; Mfg P/N Split: 100; Mfg P/N Released: Yes; Part Number: UBXH01-0023019; Tolerance: 10%; Max Voltage: 16V; Part Type: Capacitor; Release Data: 2013-08-21T12:21:41; UBX Wiki: https://wiki.u-blox.com/bin/view/Operations/PartDetails?index=5479; RefDes: C; Mfg P/N Datasheet: https://wiki.u-blox.com/bin/view/Generic/Docs/DocumentSummary?index=19430
D2 = UBXH11-5006003: LED CHIP 0603 LOW CURRENT VISHAY RED 2mA; Editor: roland.rust; Env: ROHS; Permitted Use: Support Products; Perferred: PREF; Mfg P/N Status: Active; Mfg P/N Split: 100; Mfg P/N Released: Yes; Color: *; Part Number: UBXH11-5006003; Value: RED; Max Current: 2mA; Size: 0603; Part Type: LED; Released by: roland.rust; Release Data: 2007-04-26T15:06:11; UBX Wiki: https://wiki.u-blox.com/bin/view/Operations/PartDetails?index=7585; RefDes: DS; Manufacturer: Vishay; Manufacturer P/N: TLMS 1000
D3 = CMP-2000-06115-2: DIODE SCHOTTKY 30V 2A MFLAT; Manufacturer: TOSHIBA; Forward Voltage: 370mV; Peak Non-Repetitive Surge Current: 40A; Max Reverse Leakage Current: 3mA; Element Configuration: Single; Package Quantity: 1; Max Operating Temperature: 125°C; Mount: Surface Mount; Max Repetitive Reverse Voltage (Vrrm): 30V; Forward Current: 2A; Number of Pins: 2; Min Operating Temperature: -40°C; Radiation Hardening: No; Average Rectified Current: 2A; Contact Plating: Tin; Max Reverse Voltage (DC): 30V; Peak Reverse Current: 3mA; Max Surge Current: 40A; Packaging: Tape and Reel; Manufacturer P/N: CMS06(TE12L,Q,M)
D11 D14 = 110-00018: TVS Diode, ESD High Speed 3-Channel Array, SOT-553; Manufacturer 1: Texas Instruments; Part Name: Diode TVS 5V 3CH SOT-553; Body Size: 1.60mm x 1.20mm; Current: None; Item Phase: In Production; MFG Package: SOT-553, DRL (R-PDSO-N5); Use in new designs: Yes; Voltage: 5.5V; Manufacturer P/N: *; Part Number: 110-00018; Supplier 1: Digi-Key; Supplier Part Number 1: 296-21885-1-ND; Manufacturer 2: None; Manufacturer Part Number 2: None; Supplier 2: None; Supplier Part Number 2: None; Height: 0.60mm; Max Operating Temp: 85; Min Operating Temp: -40; Pins: 5; Revision: 0A; UBX Code: None
D12 = CMP-2000-06115-2: Diode Schottky 30 V 2A Surface Mount M-FLAT (2.4x3.8); Manufacturer: Toshiba; Forward Voltage: 370mV; Peak Non-Repetitive Surge Current: 40A; Max Repetitive Reverse Voltage (Vrrm): 30V; Max Reverse Leakage Current: 3mA; Element Configuration: Single; Package Quantity: 1; Max Operating Temperature: 125°C; Mount: Surface Mount; Forward Current: 2A; Number of Pins: 2; Min Operating Temperature: -40°C; Radiation Hardening: No; Average Rectified Current: 2A; Contact Plating: Tin; Max Reverse Voltage (DC): 30V; Peak Reverse Current: 3mA; Max Surge Current: 40A; Packaging: Tape and Reel; Manufacturer P/N: CMS06(TE12L,Q,M)
D13 = CMP-2000-06115-2: Diode Schottky 30 V 2A Surface Mount M-FLAT (2.4x3.8); Manufacturer: TOSHIBA; Forward Voltage: 370mV; Peak Non-Repetitive Surge Current: 40A; Max Repetitive Reverse Voltage (Vrrm): 30V; Max Reverse Leakage Current: 3mA; Element Configuration: Single; Package Quantity: 1; Max Operating Temperature: 125°C; Mount: Surface Mount; Forward Current: 2A; Number of Pins: 2; Min Operating Temperature: -40°C; Radiation Hardening: No; Average Rectified Current: 2A; Contact Plating: Tin; Max Reverse Voltage (DC): 30V; Peak Reverse Current: 3mA; Max Surge Current: 40A; Packaging: Tape and Reel; Manufacturer P/N: CMS06(TE12L,Q,M)
D20 = UBXH11-0000018: LED CHIP 0603 LOW CURRENT OSRAM 0.002A GREEN 2.2V 2mA; Manufacturer P/N: LG L29K-G2J1-24; Editor: johann.furrer; Released by: martin.grasse; Env: ROHS; Permitted Use: Volume Products; Perferred: PREF; Mfg P/N Status: Active; Mfg P/N Split: 100; Mfg P/N Released: Yes; Color: *; Part Number: UBXH11-0000018; Max Voltage: 2.2V; Max Current: 2mA; Size: 0603; Min Operating Temp: -40°C; Max Operating Temp: 85°C; Part Type: LED; Release Data: 2018-01-09T15:31:38; UBX Wiki: https://wiki.u-blox.com/bin/view/Operations/PartDetails?index=20619; RefDes: DS; Manufacturer: Osram; Mfg P/N Datasheet: https://wiki.u-blox.com/bin/view/Generic/Docs/DocumentSummary?index=20620
D23 = 110-00019: Diode, ESD9B, 3.3V, ST5G, SOD-923; Part Name: Diode TVS 3.3V SOD-923; Manufacturer 1: ON Semiconductor; Manufacturer Part Number 1: ESD9B3.3ST5G; Body Size: 0.8mm x 0.6mm; Use in new designs: Yes; UBX Code: None; Item Phase: In Production; Part Number: 110-00019; Supplier 1: Digi-Key; Supplier Part Number 1: ESD9B3.3ST5GOSCT-ND; Height: 0.4mm; MFG Package: SOD-923; Pins: 2; Voltage: 3.3V; Manufacturer 2: ON Semiconductor; Max Operating Temp: 150; Supplier 2: Arrow; Supplier Part Number 2: ESD9B3.3ST5G; Manufacturer Part Number 2: ESD9B3.3ST5G; Current: None; Min Operating Temp: -55; Revision: 0A
F1 F2 F8 = UBXH08-0000038: FERRITE BEAD MURATA BLM18PG 0603 120R@100MHZ 2A; Manufacturer: Murata Manufacturing Company, Ltd.; Manufacturer P/N: BLM18PG121SH1; Editor: evgenii.platonov; Env: ROHS; Permitted Use: Volume Products; Perferred: PREF; Mfg P/N Status: Active; Mfg P/N Split: 100; Mfg P/N Released: No; Part Number: UBXH08-0000038; Value: 120R@100MHZ; Max Current: 2A; Min Operating Temp: -40°C; Max Operating Temp: 125°C; Part Type: Ferrite; UBX Wiki: https://wiki.u-blox.com/bin/view/Operations/PartDetails?index=32502; RefDes: FB
J7 J67 = 130-00105: Header, 0.100" Pitch, 3 Pin, Vertical SMT, Black; Part Name: CON HDR 0.1" 3 Pin 1 Row SMT; Manufacturer 1: Harwin Inc; Manufacturer Part Number 1: M20-8770342; Use in new designs: Yes; UBX Code: None; Item Phase: In Production; Manufacturer P/N: *; Part Number: 130-00105; Supplier 1: Digi-Key; Supplier Part Number 1: 952-1951-ND; Height: 9.93mm; Pins: 3; Manufacturer 2: Greenconn Corporation; Max Operating Temp: None; Supplier 2: Teamwise Limited; Supplier Part Number 2: Greenconn Corporation GPHC1010302A081B1BD; Voltage: None; Diameter: None; Min Operating Temp: None; Revision: 0C; Manufacturer Part Number 2: GPHC1010302A081B1BD
J38 = UBXH14-0000681: SHORT RANGE STAND-ALONE MULTIRADIO MODULE U-BLOX IRIS-W106; Editor: olof.viklund; Env: ROHS; Permitted Use: Volume Products; Perferred: PREF; Part Number: UBXH14-0000681; Min Operating Temp: -40°C; Max Operating Temp: 85°C; Part Type: RF; UBX Wiki: https://wiki.u-blox.com/bin/view/Operations/PartDetails?index=38240; RefDes: A
J42 = 61300211121: No Description Available; Mfr_Name: Wurth Electronics; RefDes: RefDes; Type: Type
J72 J98 = 130-00150: Connector, USB-C Receptacle, 24 Position, Surface Mount, Right Angle, Horizontal, 20V; Manufacturer 1: JAE Electronics; Manufacturer Part Number 1: DX07S024JJ3R1300; Part Name: CON USB C 0.5 mm 24 Pin 2 Row Right Angle White; Item Phase: Unreleased; Use in new designs: Yes; UBX Code: None; Manufacturer P/N: *; Part Number: 130-00150; Supplier 1: Digi-Key; Supplier Part Number 1: 670-2846-1-ND; Diameter: None; Height: 3.29mm; Max Operating Temp: 80; Min Operating Temp: -30; Pins: 24; Revision: None; Voltage: 20V; Manufacturer 2: None; Manufacturer Part Number 2: None; Supplier 2: None; Supplier Part Number 2: None
J94 J95 J115 J116 = Solderbridge-Open: Added By: Paul B; Part Number: Solderbridge-Open; Height: 0; DNP: DNP; Added Date: 12/2/2015
J96 J97 = Solderbridge-Short: Added By: Paul B; Part Number: Solderbridge-Short; Height: 0; DNP: DNP; Added Date: 12/2/2015
L2 = UBXH09-0000025: IND MURATA LQM2MP 0806 2U2 30% 1.2A; Manufacturer: Murata Manufacturing Company, Ltd.; Manufacturer P/N: LQM2MPN2R2NG0; Editor: martin.pilik; Released by: fabrice.bret-dibat; Env: GREEN; Permitted Use: Volume Products; Perferred: PREF; Mfg P/N Status: Active; Mfg P/N Split: 100; Mfg P/N Released: Yes; Part Number: UBXH09-0000025; Tolerance: 30%; Max Current: 1.2A; Min Operating Temp: -55°C; Max Operating Temp: 125°C; Part Type: Inductor; Release Data: 2021-05-07T14:56:17; UBX Wiki: https://wiki.u-blox.com/bin/view/Operations/PartDetails?index=9109; RefDes: L; Mfg P/N Datasheet: https://wiki.u-blox.com/bin/view/Generic/Docs/DocumentSummary?index=9215
L3 = UBXH09-0000176: SHIELDED POWER INDUCTOR XFL4020 2U2 20% 3.1A; Manufacturer: Coilcraft; Manufacturer P/N: XFL4020-222ME; Editor: roland.rust; Released by: olof.viklund; Env: ROHS; Permitted Use: Support Products; Perferred: PREF; Mfg P/N Status: Active; Mfg P/N Split: 100; Mfg P/N Released: Yes; Part Number: UBXH09-0000176; Tolerance: 20%; Max Current: 3.1A; Min Operating Temp: -40°C; Max Operating Temp: 125°C; Part Type: Inductor; Release Data: 2015-06-17T10:51:21; UBX Wiki: https://wiki.u-blox.com/bin/view/Operations/PartDetails?index=22578; RefDes: L; Mfg P/N Datasheet: https://wiki.u-blox.com/bin/view/Generic/Docs/DocumentSummary?index=22577
Q2 = 140-00017: N-MOSFET, 60V, 310mA, SOT-323-3; Manufacturer 1: Fairchild Semiconductor; Manufacturer Part Number 1: 2N7002KW; Part Name: MOSFET N-CH 60V 310mA SOT-323; Body Size: None; Item Phase: Pre-Production; Transistor Type: N-Channel; Thermal Pad: No; Use in new designs: Yes; Part Number: 140-00017; Supplier 1: Digi-Key; Supplier Part Number 1: 2N7002KWCT-ND; Current: 310mA; Height: 0.95mm; MFG Package: SOT-323; Max Operating Temp: 150; Min Operating Temp: -55; Pins: 3; Revision: 1; Voltage: 60V; UBX Code: None; Manufacturer 2: None; Manufacturer Part Number 2: None; Supplier 2: None; Supplier Part Number 2: None
R35 R40 R62 R126 = UBXH18-0003001: RES THICK FILM CHIP 0603 0R 0 100mW; Manufacturer: YAGEO; Manufacturer P/N: RC0603JR-070RL; Tolerance: 0; Editor: martin.frauchiger; Env: ROHS; Permitted Use: Volume Products; Perferred: PREF; Mfg P/N Status: Active; Mfg P/N Split: 100; Mfg P/N Released: Yes; Part Number: UBXH18-0003001; Max Power: 100mW; Part Type: Resistor; Released by: martin.frauchiger; Release Data: 2005-07-14T10:55:51; UBX Wiki: https://wiki.u-blox.com/bin/view/Operations/PartDetails?index=6609; RefDes: R
R39 R113 = UBXH18-0000005: RES THICK FILM CHIP 0402 100K 1% 63mW; Manufacturer: KOA; Manufacturer P/N: RK73H1ETTP1003F; Editor: dario.antonaz; Released by: sandro.sestan; Env: ROHS; Permitted Use: Volume Products; Mfg P/N Status: Active; Mfg P/N Split: 100; Mfg P/N Released: Yes; Part Number: UBXH18-0000005; Tolerance: 1%; Max Power: 63mW; Part Type: Resistor; Release Data: 2009-11-30T11:05:22; UBX Wiki: https://wiki.u-blox.com/bin/view/Operations/PartDetails?index=8114; Perferred: N/A; RefDes: R; Mfg P/N Datasheet: https://wiki.u-blox.com/bin/view/Generic/Docs/DocumentSummary?index=8222; Manufacturer 2: ROHM; Manufacturer P/N 2: MCR01MZPF1003; Mfg P/N Status 2: Active; Mfg P/N Split 2: 0; Mfg P/N Released 2: Yes; Mfg P/N Datasheet 2: https://wiki.u-blox.com/bin/view/Generic/Docs/DocumentSummary?index=8186
R69 R110 = UBXH18-0008041: RES THICK FILM CHIP 0402 470R 5% 100mW; Manufacturer: ROHM; Manufacturer P/N: MCR01MZPJ471; Editor: roland.rust; Env: ROHS; Permitted Use: Volume Products; Perferred: PREF; Mfg P/N Status: Active; Mfg P/N Split: 100; Mfg P/N Released: Yes; Part Number: UBXH18-0008041; Tolerance: 5%; Max Power: 100mW; Part Type: Resistor; Released by: roland.rust; Release Data: 2009-04-24T14:36:39; UBX Wiki: https://wiki.u-blox.com/bin/view/Operations/PartDetails?index=6926; RefDes: R; Manufacturer 2: KOA; Manufacturer P/N 2: RK73B1ETTP471J; Mfg P/N Status 2: Active; Mfg P/N Split 2: 0; Mfg P/N Released 2: Yes; Manufacturer 3: YAGEO; Manufacturer P/N 3: 2322_705_87471_L; Mfg P/N Status 3: NRND; Mfg P/N Split 3: 0; Mfg P/N Released 3: Yes
R95 R96 = UBXH18-0008066: RES THICK FILM CHIP 0402 5K1 5% 100mW; Manufacturer: Panasonic; Manufacturer P/N: ERJ-2GEJ512X; Editor: alvaro.nussbaum; Released by: roland.rust; Env: ROHS; Permitted Use: Internal Use; Perferred: NONPREF; Mfg P/N Status: Active; Mfg P/N Split: 100; Mfg P/N Released: No; Part Number: UBXH18-0008066; Tolerance: 5%; Max Power: 100mW; Part Type: Resistor; Release Data: 2016-02-11T15:22:01; UBX Wiki: https://wiki.u-blox.com/bin/view/Operations/PartDetails?index=6972; RefDes: R
R106-R109 = UBXH18-0000010: RES THICK FILM CHIP 0603 100PPM TEMP 5K1 1% 75V 100mW; Manufacturer: Vishay; Manufacturer P/N: CRCW06035K10FKEA; Editor: jeyawarman.sinnarasa; Released by: daniel.hurni; Env: ROHS; Permitted Use: Internal Use; Perferred: PREF; Mfg P/N Status: Active; Mfg P/N Split: 100; Mfg P/N Released: No; Part Number: UBXH18-0000010; Tolerance: 1%; Max Voltage: 75V; Max Power: 100mW; Min Operating Temp: -55°C; Max Operating Temp: 125°C; Part Type: Resistor; Release Data: 2010-02-18T08:54:07; UBX Wiki: https://wiki.u-blox.com/bin/view/Operations/PartDetails?index=8409; RefDes: R
R120-R122 R124 = UBXH18-0000020: RES THICK FILM CHIP 1206 0R 0 2A; Manufacturer: KOA; Manufacturer P/N: RK73Z2BT; Tolerance: 0; Editor: massimo.vlacci; Released by: erian.bezhani; Env: ROHS; Permitted Use: Support Products; Perferred: PREF; Mfg P/N Status: NRND; Mfg P/N Split: 100; Mfg P/N Released: Yes; Part Number: UBXH18-0000020; Max Current: 2A; Min Operating Temp: -55°C; Max Operating Temp: 125°C; Part Type: Resistor; Release Data: 2010-03-15T11:02:19; UBX Wiki: https://wiki.u-blox.com/bin/view/Operations/PartDetails?index=8587; RefDes: R; Mfg P/N Datasheet: https://wiki.u-blox.com/bin/view/Generic/Docs/DocumentSummary?index=8616
R123 R209 = 180-00024: Resistor 10k ohm 1% 1/16W, 0402; Manufacturer 1: Samsung Electro-Mechanics America, Inc; Manufacturer Part Number 1: RC1005F103CS; Part Name: RES SMD 10K OHM 1% 1/16W 0402; Item Phase: In Production; Tolerance: +/- 1%; Use in new designs: Yes; UBX Code: None; Part Number: 180-00024; Supplier 1: Digi-Key; Supplier Part Number 1: 1276-3431-1-ND; Manufacturer 2: Hong Kong Resistors Manufactory; Manufacturer Part Number 2: RCT0210KFLF; Supplier 2: None; Supplier Part Number 2: None; Height: 0.4mm; Max Operating Temp: 155; Min Operating Temp: -55; Pins: 2; Power: 1/16W; Revision: 0E; Voltage: N/A
SW6 = 137-00006: Switch Slide DPDT, 300mA, 6V, SMT; Part Name: Switch Slide DPDT 300mA 6V SMT; Manufacturer 1: C&K Components; Manufacturer Part Number 1: JS202011SCQN; Use in new designs: Yes; UBX Code: None; Item Phase: In Production; Manufacturer P/N: *; Part Number: 137-00006; Supplier 1: Digi-Key; Supplier Part Number 1: 401-2002-1-ND; Current: 300mA; Height: 3.5mm; Pins: 6; Voltage: 6V; Manufacturer 2: Seeed Technology; Max Operating Temp: 85; Supplier 2: Seeed Technology; Supplier Part Number 2: Rigado 137-00006; Min Operating Temp: -40; Revision: 0B; Manufacturer Part Number 2: Rigado 137-00006
TP1 TP22 TP24 TP33 TP111 TP112 TP141 TP142 = TP10R: Testpoint, Round 1.0mm Dia; Added By: Jeremy D; Part Number: TP10R; Size: 1.0mm; Height: 0; DNP: DNP; Added Date: 2015-02-01; Checked By: Paul B; Checked Date: 2015-02-05
TP101-TP104 = TP4.5x3Sq: Testpoint, Rectangular 4.5mm x 3mm; Added By: Jeremy D; Part Number: TP4.5x3Sq; Size: 4.5mm x 3mm; Height: 0; DNP: DNP; Added Date: 2015-08-21
U6 = 265-00056: IC,MOSFET LOAD SWITCH 2.4A 3-5.5V 0.048OHM HF-ROHS; Manufacturer 1: Monolithic Power Systems Inc; Body Size: 1.6mm x 1.2mm; Current: 3A; Interface: None; Item Phase: Unreleased; Reg Outputs: 1xLoad Switch; SMT Pitch: 0.5mm; Use in new designs: Yes; Voltage: 5.5V; Manufacturer P/N: *; Part Number: 265-00056; Manufacturer Part Number 1: MP5075GTF; Supplier 1: Monolithic Power Systems Inc; Supplier Part Number 1: MP5075GTF; Application: Power Switch; Height: 0.6mm; MFG Package: SOT-563; Max Operating Temp: 125; Min Operating Temp: -40; Part Name: MP5075GTF; Pins: 6; Revision: None; Thermal Pad: N/A; UBX Code: None; Manufacturer 2: None; Manufacturer Part Number 2: None; Supplier 2: None; Supplier Part Number 2: None
U11 = UBXH12-0000160: STEP DOWN DC-DC CONVERTER 3-17V 3A TPS62132 3V3; Manufacturer: Texas Instruments; PartNumber: TPS62132RGTR; Manufacturer P/N: TPS62132RGTT; Switch Current Limit(Typ)(A): 4.2; Vout(Max)(V): 3.3; Iout(Max)(A): 3; Regulated Outputs(#): 1; Rating: Catalog; Vin(Max)(V): 17; Synchronous Rectification: TRUE; SubFamily: Step-Down Regulator; Eco-Plan: Green (RoHS & no Sb/Br); Duty Cycle(Max)(%): 100; Iq(Typ)(mA): 0.017; Topology: Buck; Editor: andre.pick; Released by: alvaro.nussbaum; Env: GREEN; Permitted Use: Support Products; Perferred: PREF; Mfg P/N Status: Active; Mfg P/N Released: Yes; DatasheetVersion: SLVSAG7; ComponentLink3Description: URL Link1; ComponentLink1Description: Datasheet; Vin(Min)(V): 3; PackageDescription: 16-Pin Plastic Quad Flat No-Lead, 3 x 3 mm Body, 0.5 mm Pitch, 1.7 x 1.7 mm Exposed Pad; Mounting Technology: Surface Mount; Preset Vout(V): 3.3; Code_JEDEC: MO-220; ComponentLink1URL: http://www.ti.com/general/docs/lit/getliterature.tsp?genericPartNumber=TPS62132&fileType=pdf; Vout(Min)(V): 3.3; ComponentLink2URL: http://www.ti.com/litv/pdf/mpqf119g; ComponentLink2Description: Package Specification; PackageReference: RGT0016C; PackageVersion: revH, Oct-2011; ComponentLink3URL: Samples URL:http://www.ti.com/product/tps62132#samples; Part Number: UBXH12-0000160; Value: 3V3; Min Operating Temp: -40°C; Max Operating Temp: 85°C; Part Type: Regulator; Release Data: 2021-03-11T12:33:47; UBX Wiki: https://wiki.u-blox.com/bin/view/Operations/PartDetails?index=22570; RefDes: U; Mfg P/N Split: 100; Mfg P/N Datasheet: https://wiki.u-blox.com/bin/view/Generic/Docs/DocumentSummary?index=19244
U12 = AP2151FMG-7: Integrated Circuit; Manufacturer_Name: Diodes Inc.; Datasheet Link: https://datasheet.datasheetarchive.com/originals/distributors/Datasheets-DGA5/445518.pdf; Height: 0.605mm; Manufacturer_Part_Number: AP2151FMG-7; Mouser Part Number: 621-AP2151FMG-7; Mouser Price/Stock: https://www.mouser.co.uk/ProductDetail/Diodes-Incorporated/AP2151FMG-7?qs=oUsD4qhOtFx1r%252BOm2s%252BIKA%3D%3D; Arrow Part Number: AP2151FMG-7; Arrow Price/Stock: https://www.arrow.com/en/products/ap2151fmg-7/diodes-incorporated